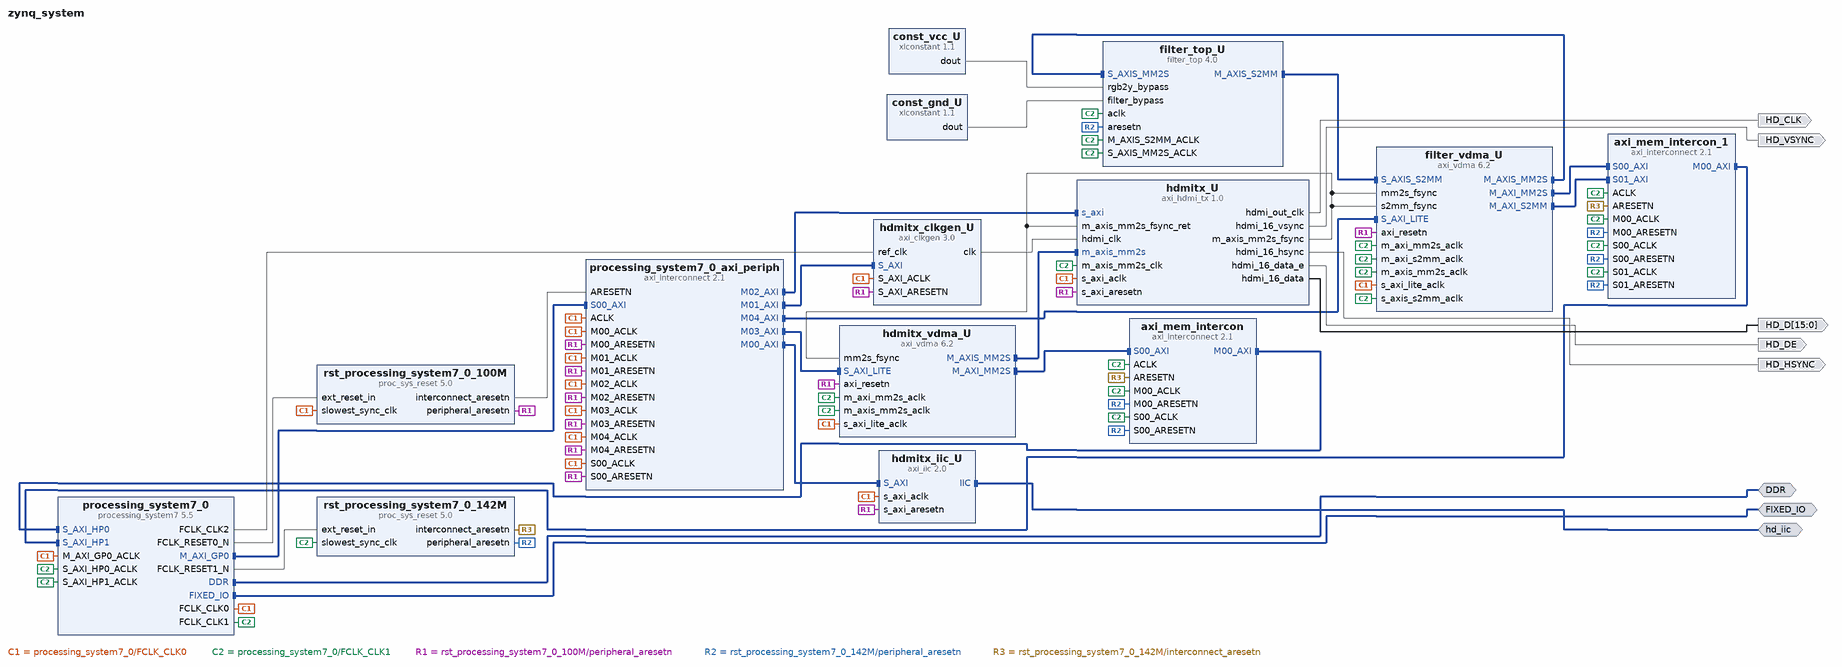
[diagram p0: block diagram of the top level]
# Vivado block design zynq_system, Vivado 2015.2
create_bd_design zynq_system

create_bd_intf_port -mode Master -vlnv xilinx.com:interface:ddrx_rtl:1.0 DDR
create_bd_intf_port -mode Master -vlnv xilinx.com:display_processing_system7:fixedio_rtl:1.0 FIXED_IO
create_bd_intf_port -mode Master -vlnv xilinx.com:interface:iic_rtl:1.0 hd_iic
create_bd_port -dir O HD_CLK
create_bd_port -dir O HD_VSYNC
create_bd_port -dir O HD_HSYNC
create_bd_port -dir O HD_DE
create_bd_port -dir O -from 15 -to 0 HD_D

create_bd_cell -type ip -vlnv xilinx.com:ip:processing_system7:5.5 processing_system7_0
set_property -dict [list \
  CONFIG.PCW_FPGA0_PERIPHERAL_FREQMHZ 100 \
  CONFIG.PCW_FPGA1_PERIPHERAL_FREQMHZ 150 \
  CONFIG.PCW_FPGA2_PERIPHERAL_FREQMHZ 200 \
  CONFIG.PCW_USE_S_AXI_HP0 1 \
  CONFIG.PCW_USE_S_AXI_HP1 1 \
  CONFIG.PCW_EN_CLK1_PORT 1 \
  CONFIG.PCW_EN_CLK2_PORT 1 \
  CONFIG.PCW_EN_RST1_PORT 1 \
  CONFIG.preset ZedBoard \
] [get_bd_cells processing_system7_0]
# 1 more settings of processing_system7_0 are not shown: defaults, MIO pin electricals, DDR timing, and values the tool derives
create_bd_cell -type ip -vlnv xilinx.com:ip:axi_iic:2.0 hdmitx_iic_U
create_bd_cell -type ip -vlnv xilinx.com:ip:axi_interconnect:2.1 processing_system7_0_axi_periph
set_property -dict {CONFIG.NUM_MI 5} [get_bd_cells processing_system7_0_axi_periph]
create_bd_cell -type ip -vlnv xilinx.com:ip:proc_sys_reset:5.0 rst_processing_system7_0_100M
create_bd_cell -type ip -vlnv cic.narl.org.tw:user:axi_clkgen:3.0 hdmitx_clkgen_U
create_bd_cell -type ip -vlnv cic.narl.org.tw:user:axi_hdmi_tx:1.0 hdmitx_U
create_bd_cell -type ip -vlnv xilinx.com:ip:axi_vdma:6.2 hdmitx_vdma_U
set_property -dict [list \
  CONFIG.c_m_axi_mm2s_data_width 64 \
  CONFIG.c_m_axis_mm2s_tdata_width 64 \
  CONFIG.c_use_mm2s_fsync 1 \
  CONFIG.c_mm2s_max_burst_length 16 \
  CONFIG.c_include_s2mm 0 \
] [get_bd_cells hdmitx_vdma_U]
create_bd_cell -type ip -vlnv xilinx.com:ip:axi_interconnect:2.1 axi_mem_intercon
set_property -dict {CONFIG.NUM_MI 1} [get_bd_cells axi_mem_intercon]
create_bd_cell -type ip -vlnv xilinx.com:ip:proc_sys_reset:5.0 rst_processing_system7_0_142M
create_bd_cell -type ip -vlnv cic.narl.org.tw:user:filter_top:4.0 filter_top_U
create_bd_cell -type ip -vlnv xilinx.com:ip:axi_vdma:6.2 filter_vdma_U
set_property -dict [list \
  CONFIG.c_m_axi_mm2s_data_width 64 \
  CONFIG.c_m_axis_mm2s_tdata_width 32 \
  CONFIG.c_m_axi_s2mm_data_width 64 \
  CONFIG.c_use_mm2s_fsync 1 \
  CONFIG.c_use_s2mm_fsync 1 \
  CONFIG.c_mm2s_max_burst_length 16 \
  CONFIG.c_s2mm_max_burst_length 16 \
] [get_bd_cells filter_vdma_U]
create_bd_cell -type ip -vlnv xilinx.com:ip:axi_interconnect:2.1 axi_mem_intercon_1
set_property -dict {CONFIG.NUM_SI 2 CONFIG.NUM_MI 1} [get_bd_cells axi_mem_intercon_1]
create_bd_cell -type ip -vlnv xilinx.com:ip:xlconstant:1.1 const_vcc_U
set_property -dict {CONFIG.CONST_WIDTH 1 CONFIG.CONST_VAL 1} [get_bd_cells const_vcc_U]
create_bd_cell -type ip -vlnv xilinx.com:ip:xlconstant:1.1 const_gnd_U
set_property -dict {CONFIG.CONST_WIDTH 1 CONFIG.CONST_VAL 0} [get_bd_cells const_gnd_U]

# ---- connections ----

connect_bd_intf_net [get_bd_intf_pins processing_system7_0/M_AXI_GP0] [get_bd_intf_pins processing_system7_0_axi_periph/S00_AXI]
connect_bd_intf_net [get_bd_intf_pins processing_system7_0_axi_periph/M00_AXI] [get_bd_intf_pins hdmitx_iic_U/S_AXI]
connect_bd_intf_net [get_bd_intf_pins processing_system7_0_axi_periph/M01_AXI] [get_bd_intf_pins hdmitx_clkgen_U/S_AXI]
connect_bd_intf_net [get_bd_intf_pins processing_system7_0_axi_periph/M02_AXI] [get_bd_intf_pins hdmitx_U/s_axi]
connect_bd_intf_net [get_bd_intf_pins processing_system7_0_axi_periph/M03_AXI] [get_bd_intf_pins hdmitx_vdma_U/S_AXI_LITE]
connect_bd_intf_net [get_bd_intf_pins hdmitx_vdma_U/M_AXI_MM2S] [get_bd_intf_pins axi_mem_intercon/S00_AXI]
connect_bd_intf_net [get_bd_intf_pins axi_mem_intercon/M00_AXI] [get_bd_intf_pins processing_system7_0/S_AXI_HP0]
connect_bd_intf_net [get_bd_intf_pins hdmitx_vdma_U/M_AXIS_MM2S] [get_bd_intf_pins hdmitx_U/m_axis_mm2s]
connect_bd_intf_net [get_bd_intf_pins processing_system7_0_axi_periph/M04_AXI] [get_bd_intf_pins filter_vdma_U/S_AXI_LITE]
connect_bd_intf_net [get_bd_intf_pins filter_vdma_U/M_AXI_MM2S] [get_bd_intf_pins axi_mem_intercon_1/S00_AXI]
connect_bd_intf_net [get_bd_intf_pins axi_mem_intercon_1/M00_AXI] [get_bd_intf_pins processing_system7_0/S_AXI_HP1]
connect_bd_intf_net [get_bd_intf_pins filter_vdma_U/M_AXI_S2MM] [get_bd_intf_pins axi_mem_intercon_1/S01_AXI]
connect_bd_intf_net [get_bd_intf_pins filter_vdma_U/M_AXIS_MM2S] [get_bd_intf_pins filter_top_U/S_AXIS_MM2S]
connect_bd_intf_net [get_bd_intf_pins filter_vdma_U/S_AXIS_S2MM] [get_bd_intf_pins filter_top_U/M_AXIS_S2MM]
connect_bd_intf_net [get_bd_intf_ports DDR] [get_bd_intf_pins processing_system7_0/DDR]
connect_bd_intf_net [get_bd_intf_ports FIXED_IO] [get_bd_intf_pins processing_system7_0/FIXED_IO]
connect_bd_intf_net [get_bd_intf_ports hd_iic] [get_bd_intf_pins hdmitx_iic_U/IIC]
connect_bd_net [get_bd_pins processing_system7_0/FCLK_CLK0] \
  [get_bd_pins processing_system7_0/M_AXI_GP0_ACLK] [get_bd_pins processing_system7_0_axi_periph/S00_ACLK] \
  [get_bd_pins rst_processing_system7_0_100M/slowest_sync_clk] [get_bd_pins processing_system7_0_axi_periph/ACLK] \
  [get_bd_pins hdmitx_iic_U/s_axi_aclk] [get_bd_pins processing_system7_0_axi_periph/M00_ACLK] \
  [get_bd_pins hdmitx_clkgen_U/S_AXI_ACLK] [get_bd_pins processing_system7_0_axi_periph/M01_ACLK] \
  [get_bd_pins hdmitx_U/s_axi_aclk] [get_bd_pins processing_system7_0_axi_periph/M02_ACLK] \
  [get_bd_pins hdmitx_vdma_U/s_axi_lite_aclk] [get_bd_pins processing_system7_0_axi_periph/M03_ACLK] \
  [get_bd_pins filter_vdma_U/s_axi_lite_aclk] [get_bd_pins processing_system7_0_axi_periph/M04_ACLK]
connect_bd_net [get_bd_pins processing_system7_0/FCLK_CLK1] \
  [get_bd_pins processing_system7_0/S_AXI_HP0_ACLK] [get_bd_pins hdmitx_vdma_U/m_axi_mm2s_aclk] \
  [get_bd_pins axi_mem_intercon/S00_ACLK] [get_bd_pins rst_processing_system7_0_142M/slowest_sync_clk] \
  [get_bd_pins axi_mem_intercon/ACLK] [get_bd_pins axi_mem_intercon/M00_ACLK] [get_bd_pins hdmitx_U/m_axis_mm2s_clk] \
  [get_bd_pins hdmitx_vdma_U/m_axis_mm2s_aclk] [get_bd_pins processing_system7_0/S_AXI_HP1_ACLK] \
  [get_bd_pins filter_vdma_U/m_axi_mm2s_aclk] [get_bd_pins axi_mem_intercon_1/S00_ACLK] [get_bd_pins axi_mem_intercon_1/ACLK] \
  [get_bd_pins axi_mem_intercon_1/M00_ACLK] [get_bd_pins filter_vdma_U/m_axi_s2mm_aclk] \
  [get_bd_pins axi_mem_intercon_1/S01_ACLK] [get_bd_pins filter_vdma_U/m_axis_mm2s_aclk] \
  [get_bd_pins filter_vdma_U/s_axis_s2mm_aclk] [get_bd_pins filter_top_U/S_AXIS_MM2S_ACLK] \
  [get_bd_pins filter_top_U/M_AXIS_S2MM_ACLK] [get_bd_pins filter_top_U/aclk]
connect_bd_net [get_bd_pins processing_system7_0/FCLK_RESET0_N] [get_bd_pins rst_processing_system7_0_100M/ext_reset_in]
connect_bd_net [get_bd_pins rst_processing_system7_0_100M/peripheral_aresetn] \
  [get_bd_pins processing_system7_0_axi_periph/S00_ARESETN] [get_bd_pins hdmitx_iic_U/s_axi_aresetn] \
  [get_bd_pins processing_system7_0_axi_periph/M00_ARESETN] [get_bd_pins hdmitx_clkgen_U/S_AXI_ARESETN] \
  [get_bd_pins processing_system7_0_axi_periph/M01_ARESETN] [get_bd_pins hdmitx_U/s_axi_aresetn] \
  [get_bd_pins processing_system7_0_axi_periph/M02_ARESETN] [get_bd_pins hdmitx_vdma_U/axi_resetn] \
  [get_bd_pins processing_system7_0_axi_periph/M03_ARESETN] [get_bd_pins filter_vdma_U/axi_resetn] \
  [get_bd_pins processing_system7_0_axi_periph/M04_ARESETN]
connect_bd_net [get_bd_pins rst_processing_system7_0_100M/interconnect_aresetn] [get_bd_pins processing_system7_0_axi_periph/ARESETN]
connect_bd_net [get_bd_pins processing_system7_0/FCLK_CLK2] [get_bd_pins hdmitx_clkgen_U/ref_clk]
connect_bd_net [get_bd_pins processing_system7_0/FCLK_RESET1_N] [get_bd_pins rst_processing_system7_0_142M/ext_reset_in]
connect_bd_net [get_bd_pins rst_processing_system7_0_142M/peripheral_aresetn] \
  [get_bd_pins axi_mem_intercon/S00_ARESETN] [get_bd_pins axi_mem_intercon/M00_ARESETN] \
  [get_bd_pins axi_mem_intercon_1/S00_ARESETN] [get_bd_pins axi_mem_intercon_1/M00_ARESETN] \
  [get_bd_pins axi_mem_intercon_1/S01_ARESETN] [get_bd_pins filter_top_U/aresetn]
connect_bd_net [get_bd_pins rst_processing_system7_0_142M/interconnect_aresetn] \
  [get_bd_pins axi_mem_intercon/ARESETN] [get_bd_pins axi_mem_intercon_1/ARESETN]
connect_bd_net [get_bd_pins hdmitx_clkgen_U/clk] [get_bd_pins hdmitx_U/hdmi_clk]
connect_bd_net [get_bd_pins hdmitx_U/m_axis_mm2s_fsync] \
  [get_bd_pins hdmitx_vdma_U/mm2s_fsync] [get_bd_pins hdmitx_U/m_axis_mm2s_fsync_ret] [get_bd_pins filter_vdma_U/mm2s_fsync] \
  [get_bd_pins filter_vdma_U/s2mm_fsync]
connect_bd_net -net const_vcc_s [get_bd_pins const_vcc_U/dout] [get_bd_pins filter_top_U/rgb2y_bypass]
connect_bd_net -net const_gnd_s [get_bd_pins const_gnd_U/dout] [get_bd_pins filter_top_U/filter_bypass]
connect_bd_net [get_bd_pins hdmitx_U/hdmi_out_clk] [get_bd_ports HD_CLK]
connect_bd_net [get_bd_pins hdmitx_U/hdmi_16_vsync] [get_bd_ports HD_VSYNC]
connect_bd_net [get_bd_pins hdmitx_U/hdmi_16_hsync] [get_bd_ports HD_HSYNC]
connect_bd_net [get_bd_pins hdmitx_U/hdmi_16_data_e] [get_bd_ports HD_DE]
connect_bd_net [get_bd_pins hdmitx_U/hdmi_16_data] [get_bd_ports HD_D]

# ---- address map ----
assign_bd_address -offset 0x00000000 -range 512M -target_address_space [get_bd_addr_spaces filter_vdma_U/Data_MM2S] [get_bd_addr_segs processing_system7_0/S_AXI_HP1/HP1_DDR_LOWOCM]
assign_bd_address -offset 0x00000000 -range 512M -target_address_space [get_bd_addr_spaces filter_vdma_U/Data_S2MM] [get_bd_addr_segs processing_system7_0/S_AXI_HP1/HP1_DDR_LOWOCM]
assign_bd_address -offset 0x00000000 -range 512M -target_address_space [get_bd_addr_spaces hdmitx_vdma_U/Data_MM2S] [get_bd_addr_segs processing_system7_0/S_AXI_HP0/HP0_DDR_LOWOCM]
assign_bd_address -offset 0x41600000 -range 64K -target_address_space [get_bd_addr_spaces processing_system7_0/Data] [get_bd_addr_segs hdmitx_iic_U/S_AXI/Reg]
assign_bd_address -offset 0x43000000 -range 64K -target_address_space [get_bd_addr_spaces processing_system7_0/Data] [get_bd_addr_segs hdmitx_vdma_U/S_AXI_LITE/Reg]
assign_bd_address -offset 0x430C0000 -range 64K -target_address_space [get_bd_addr_spaces processing_system7_0/Data] [get_bd_addr_segs filter_vdma_U/S_AXI_LITE/Reg]
assign_bd_address -offset 0x70E00000 -range 64K -target_address_space [get_bd_addr_spaces processing_system7_0/Data] [get_bd_addr_segs hdmitx_U/s_axi/reg0]
assign_bd_address -offset 0x79000000 -range 64K -target_address_space [get_bd_addr_spaces processing_system7_0/Data] [get_bd_addr_segs hdmitx_clkgen_U/S_AXI/reg0]

validate_bd_design
save_bd_design
